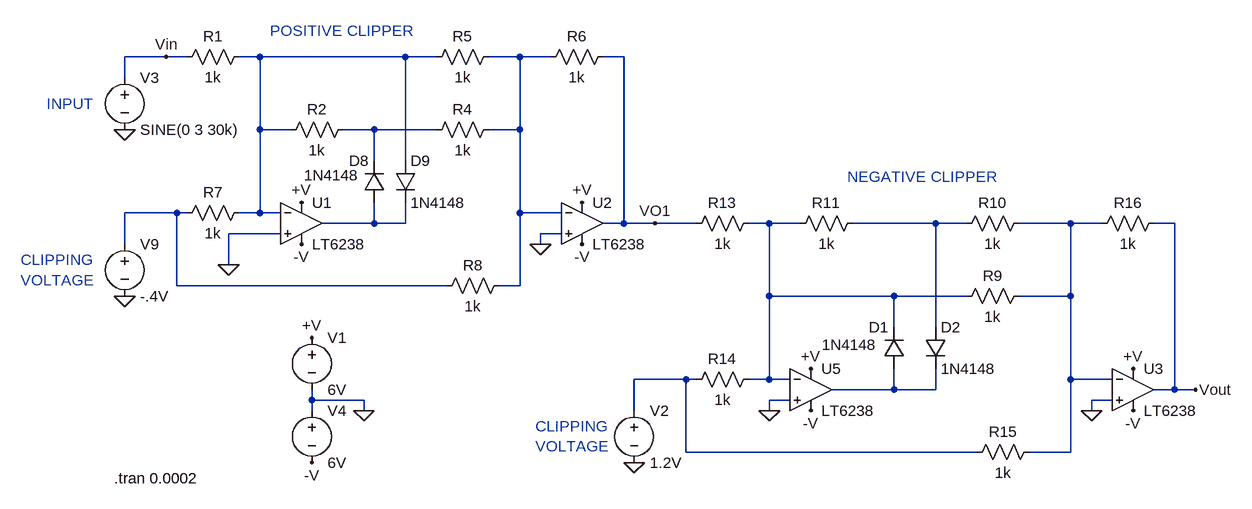
[diagram p0: schematic Positive and Negative.asc]
Positive and Negative.asc, the LTspice schematic file:
Version 4
SHEET 1 4424 696
WIRE 608 -512 544 -512
WIRE 640 -512 608 -512
WIRE 752 -512 720 -512
WIRE 976 -512 752 -512
WIRE 1024 -512 976 -512
WIRE 1152 -512 1104 -512
WIRE 1200 -512 1152 -512
WIRE 1312 -512 1280 -512
WIRE 544 -480 544 -512
WIRE 752 -400 752 -512
WIRE 800 -400 752 -400
WIRE 928 -400 880 -400
WIRE 1024 -400 928 -400
WIRE 1152 -400 1152 -512
WIRE 1152 -400 1104 -400
WIRE 928 -352 928 -400
WIRE 976 -352 976 -512
WIRE 624 -272 544 -272
WIRE 640 -272 624 -272
WIRE 752 -272 752 -400
WIRE 752 -272 720 -272
WIRE 784 -272 752 -272
WIRE 1152 -272 1152 -400
WIRE 1216 -272 1152 -272
WIRE 928 -256 928 -288
WIRE 928 -256 848 -256
WIRE 976 -256 976 -288
WIRE 976 -256 928 -256
WIRE 1312 -256 1312 -512
WIRE 1312 -256 1280 -256
WIRE 1360 -256 1312 -256
WIRE 1424 -256 1360 -256
WIRE 1536 -256 1504 -256
WIRE 1584 -256 1536 -256
WIRE 1792 -256 1664 -256
WIRE 1840 -256 1792 -256
WIRE 2000 -256 1920 -256
WIRE 2048 -256 2000 -256
WIRE 2160 -256 2128 -256
WIRE 784 -240 704 -240
WIRE 1216 -240 1184 -240
WIRE 544 -224 544 -272
WIRE 1184 -224 1184 -240
WIRE 704 -192 704 -240
WIRE 624 -160 624 -272
WIRE 1040 -160 624 -160
WIRE 1152 -160 1152 -272
WIRE 1152 -160 1120 -160
WIRE 1536 -144 1536 -256
WIRE 1728 -144 1536 -144
WIRE 1840 -144 1728 -144
WIRE 2000 -144 2000 -256
WIRE 2000 -144 1920 -144
WIRE 1728 -96 1728 -144
WIRE 1792 -96 1792 -256
WIRE 1408 -16 1328 -16
WIRE 1424 -16 1408 -16
WIRE 1536 -16 1536 -144
WIRE 1536 -16 1504 -16
WIRE 1568 -16 1536 -16
WIRE 2000 -16 2000 -144
WIRE 2064 -16 2000 -16
WIRE 1728 0 1728 -32
WIRE 1728 0 1632 0
WIRE 1792 0 1792 -32
WIRE 1792 0 1728 0
WIRE 2160 0 2160 -256
WIRE 2160 0 2128 0
WIRE 2192 0 2160 0
WIRE 832 16 832 0
WIRE 912 16 832 16
WIRE 1568 16 1536 16
WIRE 2064 16 2032 16
WIRE 832 32 832 16
WIRE 912 32 912 16
WIRE 1328 32 1328 -16
WIRE 1536 32 1536 16
WIRE 2032 32 2032 16
WIRE 1408 96 1408 -16
WIRE 1856 96 1408 96
WIRE 2000 96 2000 -16
WIRE 2000 96 1936 96
FLAG 544 -400 0
FLAG 816 -288 +V
FLAG 816 -224 -V
FLAG 704 -192 0
FLAG 1248 -288 +V
FLAG 1248 -224 -V
FLAG 1184 -224 0
FLAG 544 -144 0
FLAG 608 -512 Vin
FLAG 1600 -32 +V
FLAG 1600 32 -V
FLAG 1536 32 0
FLAG 2096 -32 +V
FLAG 2096 32 -V
FLAG 2032 32 0
FLAG 1328 112 0
FLAG 912 32 0
FLAG 832 -80 +V
FLAG 832 112 -V
FLAG 2192 0 Vout
FLAG 1360 -256 VO1
SYMBOL voltage 544 -496 R0
WINDOW 123 0 0 Left 0
WINDOW 39 0 0 Left 0
SYMATTR InstName V3
SYMATTR Value SINE(0 3 30k)
SYMBOL diode 944 -288 R180
WINDOW 0 24 64 Left 2
WINDOW 3 39 42 Left 2
SYMATTR InstName D8
SYMATTR Value 1N4148
SYMBOL diode 960 -352 R0
SYMATTR InstName D9
SYMATTR Value 1N4148
SYMBOL res 1120 -416 R90
WINDOW 0 0 56 VBottom 2
WINDOW 3 32 56 VTop 2
SYMATTR InstName R4
SYMATTR Value 1k
SYMBOL res 1120 -528 R90
WINDOW 0 0 56 VBottom 2
WINDOW 3 32 56 VTop 2
SYMATTR InstName R5
SYMATTR Value 1k
SYMBOL res 896 -416 R90
WINDOW 0 0 56 VBottom 2
WINDOW 3 32 56 VTop 2
SYMATTR InstName R2
SYMATTR Value 1k
SYMBOL res 736 -528 R90
WINDOW 0 0 56 VBottom 2
WINDOW 3 32 56 VTop 2
SYMATTR InstName R1
SYMATTR Value 1k
SYMBOL res 736 -288 R90
WINDOW 0 0 56 VBottom 2
WINDOW 3 32 56 VTop 2
SYMATTR InstName R7
SYMATTR Value 1k
SYMBOL res 1136 -176 R90
WINDOW 0 0 56 VBottom 2
WINDOW 3 32 56 VTop 2
SYMATTR InstName R8
SYMATTR Value 1k
SYMBOL res 1296 -528 R90
WINDOW 0 0 56 VBottom 2
WINDOW 3 32 56 VTop 2
SYMATTR InstName R6
SYMATTR Value 1k
SYMBOL voltage 544 -240 R0
WINDOW 123 0 0 Left 0
WINDOW 39 0 0 Left 0
SYMATTR InstName V9
SYMATTR Value -.4V
SYMBOL diode 1744 -32 R180
WINDOW 0 24 64 Left 2
WINDOW 3 42 37 Left 2
SYMATTR InstName D1
SYMATTR Value 1N4148
SYMBOL diode 1776 -96 R0
SYMATTR InstName D2
SYMATTR Value 1N4148
SYMBOL res 1936 -160 R90
WINDOW 0 0 56 VBottom 2
WINDOW 3 32 56 VTop 2
SYMATTR InstName R9
SYMATTR Value 1k
SYMBOL res 1936 -272 R90
WINDOW 0 0 56 VBottom 2
WINDOW 3 32 56 VTop 2
SYMATTR InstName R10
SYMATTR Value 1k
SYMBOL res 1680 -272 R90
WINDOW 0 0 56 VBottom 2
WINDOW 3 32 56 VTop 2
SYMATTR InstName R11
SYMATTR Value 1k
SYMBOL res 1520 -272 R90
WINDOW 0 0 56 VBottom 2
WINDOW 3 32 56 VTop 2
SYMATTR InstName R13
SYMATTR Value 1k
SYMBOL res 1520 -32 R90
WINDOW 0 0 56 VBottom 2
WINDOW 3 32 56 VTop 2
SYMATTR InstName R14
SYMATTR Value 1k
SYMBOL res 1952 80 R90
WINDOW 0 0 56 VBottom 2
WINDOW 3 32 56 VTop 2
SYMATTR InstName R15
SYMATTR Value 1k
SYMBOL res 2144 -272 R90
WINDOW 0 0 56 VBottom 2
WINDOW 3 32 56 VTop 2
SYMATTR InstName R16
SYMATTR Value 1k
SYMBOL voltage 1328 16 R0
WINDOW 123 0 0 Left 0
WINDOW 39 0 0 Left 0
SYMATTR InstName V2
SYMATTR Value 1.2V
SYMBOL Opamps\\LT6238 816 -256 R0
SYMATTR InstName U1
SYMBOL Opamps\\LT6238 1600 0 R0
SYMATTR InstName U5
SYMBOL voltage 832 -96 R0
WINDOW 123 0 0 Left 0
WINDOW 39 0 0 Left 0
SYMATTR InstName V1
SYMATTR Value 6V
SYMBOL voltage 832 16 R0
WINDOW 123 0 0 Left 0
WINDOW 39 0 0 Left 0
SYMATTR InstName V4
SYMATTR Value 6V
SYMBOL Opamps\\LT6238 1248 -256 R0
SYMATTR InstName U2
SYMBOL Opamps\\LT6238 2096 0 R0
SYMATTR InstName U3
TEXT 528 136 Left 2 !.tran 0.0002
TEXT 768 -552 Left 2 ;POSITIVE CLIPPER
TEXT 424 -440 Left 2 ;INPUT
TEXT 384 -200 Left 2 ;CLIPPING\nVOLTAGE
TEXT 1176 56 Left 2 ;CLIPPING\nVOLTAGE
TEXT 1656 -328 Left 2 ;NEGATIVE CLIPPER

The netlist it stands for:
* Positive and Negative.asc
V3 Vin 0 SINE(0 3 30k)
D8 N005 N003 1N4148
D9 N001 N005 1N4148
R4 N002 N003 1k
R5 N002 N001 1k
R2 N003 N001 1k
R1 N001 Vin 1k
R7 N001 N004 1k
R8 N002 N004 1k
R6 VO1 N002 1k
V9 N004 0 -.4V
D1 N010 N006 1N4148
D2 N007 N010 1N4148
R9 N008 N006 1k
R10 N008 N007 1k
R11 N007 N006 1k
R13 N006 VO1 1k
R14 N006 N009 1k
R15 N008 N009 1k
R16 Vout N008 1k
V2 N009 0 1.2V
* U1: LT6238 (symbol Opamps\LT6238 not available, pins judged from their places): In+=0 In-=N001 V+=+V V-=-V OUT=N005
* U5: LT6238 (symbol Opamps\LT6238 not available, pins judged from their places): In+=0 In-=N006 V+=+V V-=-V OUT=N010
V1 +V 0 6V
V4 0 -V 6V
* U2: LT6238 (symbol Opamps\LT6238 not available, pins judged from their places): In+=0 In-=N002 V+=+V V-=-V OUT=VO1
* U3: LT6238 (symbol Opamps\LT6238 not available, pins judged from their places): In+=0 In-=N008 V+=+V V-=-V OUT=Vout
.model D D
.lib standard.dio
.tran 0.0002
* POSITIVE CLIPPER
* INPUT
* CLIPPING
* VOLTAGE
* CLIPPING
* VOLTAGE
* NEGATIVE CLIPPER
.backanno
.end